# EAGLE schematic SmartGarden (EAGLE 9.6.2)
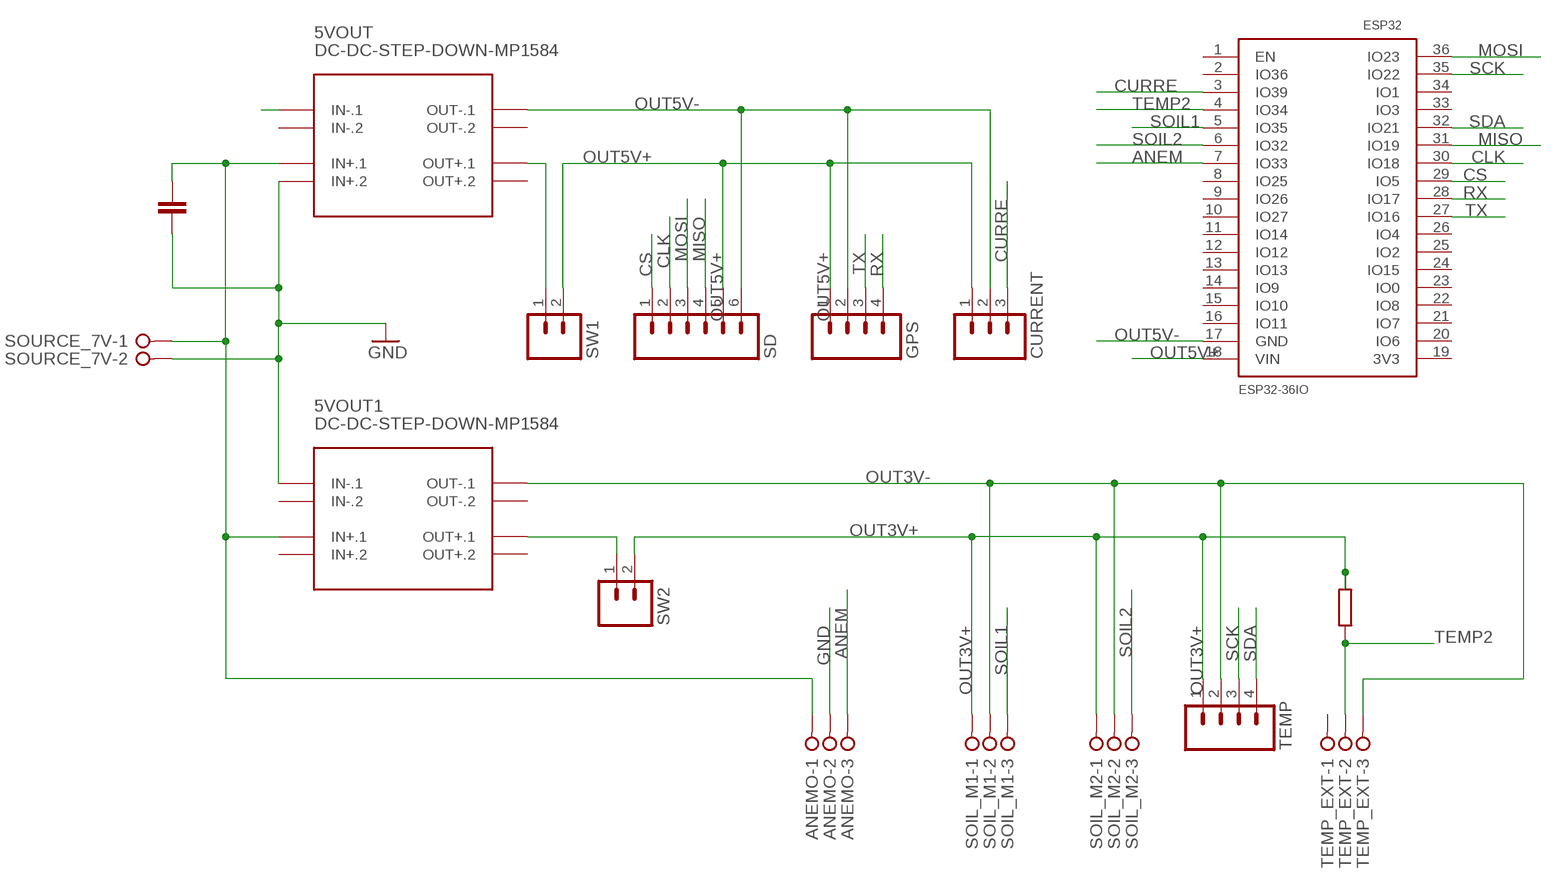
[diagram p0: schematic, sheet 1]

## Parts
5VOUT  DC-DC-STEP-DOWN-MP1584  [DC-DC-STEP-DOWN-MP1584]
5VOUT1  DC-DC-STEP-DOWN-MP1584  [DC-DC-STEP-DOWN-MP1584]
ANEMO  W237-3E  [W237-3E]
C0  C-EU025-025X050  [C025-025X050]
CURRENT  M03  [03P]
ESP32  ESP32-36IO  [ESP32-36-GPIO]
GPS  M04  [04P]
R1  R-EU_0204/7  [0204/7]
SD  M06  [06P]
SOIL_M1  W237-3E  [W237-3E]
SOIL_M2  W237-3E  [W237-3E]
SOURCE_7V  W237-02P  [W237-132]
SW1  M02  [02P]
SW2  M02  [02P]
TEMP  M04  [04P]
TEMP_EXT  W237-3E  [W237-3E]

## Nets
7V: 5VOUT1.IN+.1 5VOUT.IN+.1 ANEMO.1 C0.1 SOURCE_7V.1
ANEM: ANEMO.3 ESP32.7(IO33)
CLK: ESP32.30(IO18) SD.2
CS: ESP32.29(IO5) SD.1
CURRE: CURRENT.3 ESP32.3(IO39)
GND: 5VOUT1.IN-.1 5VOUT.IN+.2 ANEMO.2 C0.2 SOURCE_7V.2
MISO: ESP32.31(IO19) SD.4
MOSI: ESP32.36(IO23) SD.3
N$1: 5VOUT.IN-.1
N$2: 5VOUT1.OUT+.1 SW2.1
N$3: 5VOUT.OUT+.1 SW1.1
OUT3V+: R1.2 SOIL_M1.1 SOIL_M2.1 SW2.2 TEMP.1
OUT3V-: 5VOUT1.OUT-.1 SOIL_M1.2 SOIL_M2.2 TEMP.2 TEMP_EXT.3
OUT5V+: CURRENT.1 ESP32.18(VIN) GPS.1 SD.5 SW1.2
OUT5V-: 5VOUT.OUT-.1 CURRENT.2 ESP32.17(GND) GPS.2 SD.6
RX: ESP32.28(IO17) GPS.4
SCK: ESP32.35(IO22) TEMP.3
SDA: ESP32.32(IO21) TEMP.4
SOIL1: ESP32.5(IO35) SOIL_M1.3
SOIL2: ESP32.6(IO32) SOIL_M2.3
TEMP2: ESP32.4(IO34) R1.1 TEMP_EXT.2
TX: ESP32.27(IO16) GPS.3
Unconnected: 5VOUT1.IN+.2 5VOUT1.IN-.2 5VOUT1.OUT+.2 5VOUT1.OUT-.2 5VOUT.IN-.2 5VOUT.OUT+.2 5VOUT.OUT-.2 ESP32.1(EN) ESP32.2(IO36) ESP32.8(IO25) ESP32.9(IO26) ESP32.10(IO27) ESP32.11(IO14) ESP32.12(IO12) ESP32.13(IO13) ESP32.14(IO9) ESP32.15(IO10) ESP32.16(IO11) ESP32.19(3V3) ESP32.20(IO6) ESP32.21(IO7) ESP32.22(IO8) ESP32.23(IO0) ESP32.24(IO15) ESP32.25(IO2) ESP32.26(IO4) ESP32.33(IO3) ESP32.34(IO1) TEMP_EXT.1

## Library data of the parts
5VOUT 5VOUT1 = diy-modules:DC-DC-STEP-DOWN-MP1584: DC/DC Step-Down Regulator based on MP1584 chip MP1584 datasheet available here: http://www.haoyuelectronics.com/Attachment/MP1584/MP1584.pdf Click here to find device on ebay.com <http://www.ebay.com/sch/mp1584+module>
ANEMO SOIL_M1 SOIL_M2 TEMP_EXT = con-wago-508:W237-3E: WAGO SREW CLAMP; OC_FARNELL: unknown; OC_NEWARK: unknown
C0 = rcl:C-EU: CAPACITOR, European symbol; SPICEPREFIX: C
CURRENT = con-amp-quick:M03: AMP QUICK CONNECTOR; OC_FARNELL: unknown; OC_NEWARK: unknown
ESP32 = ESP32:ESP32-36IO
GPS TEMP = con-amp-quick:M04: AMP QUICK CONNECTOR; OC_FARNELL: unknown; OC_NEWARK: unknown
R1 = rcl:R-EU_: RESISTOR, European symbol; SPICEPREFIX: R
SD = con-amp-quick:M06: AMP QUICK CONNECTOR; OC_FARNELL: unknown; OC_NEWARK: unknown
SOURCE_7V = con-wago-508:W237-02P: WAGO SREW CLAMP; OC_FARNELL: unknown; OC_NEWARK: unknown
SW1 SW2 = con-amp-quick:M02: AMP QUICK CONNECTOR; OC_FARNELL: unknown; OC_NEWARK: unknown

## Net classes
0 default: width 0.305 mm, drill 0.508 mm, clearance 0.254 mm